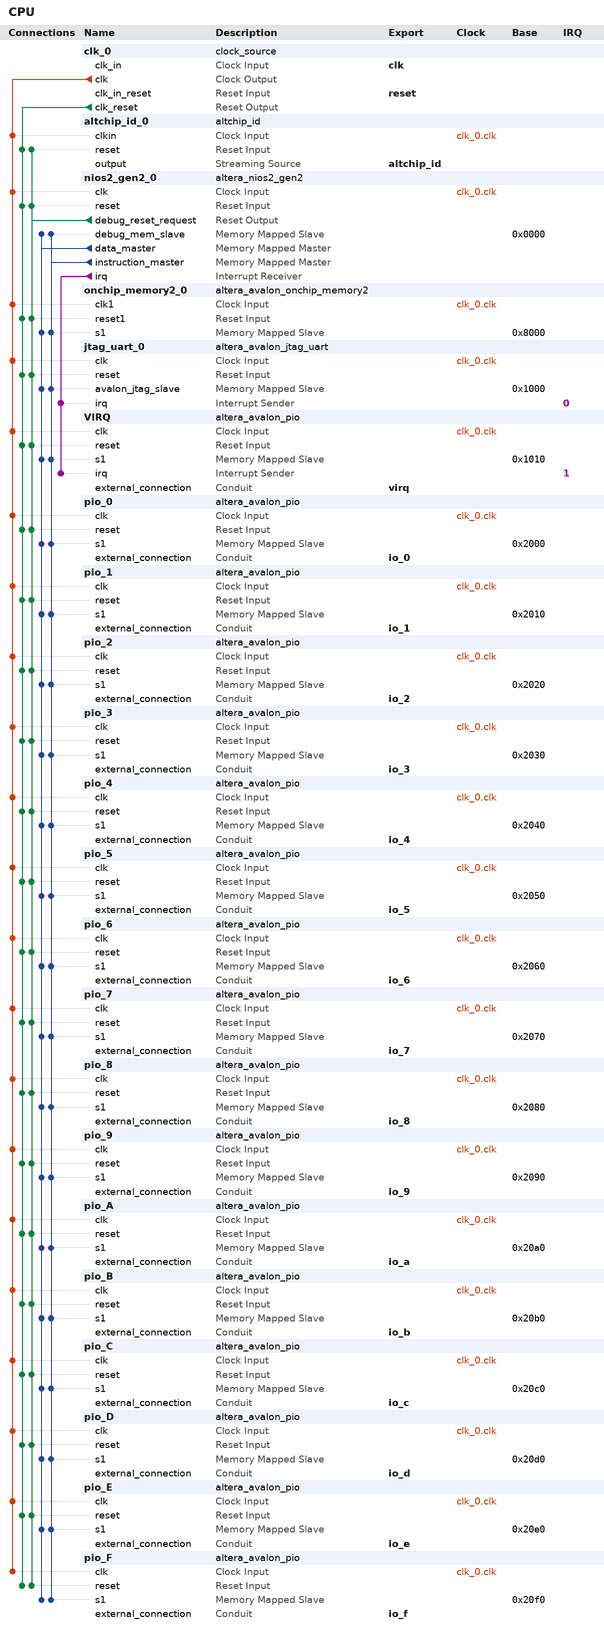
[diagram p0: system contents]
# Platform Designer (Qsys) system CPU, MAX 10 10M08SAE144C8G
# Parameters at their usual value, and those the tool derives, are not listed.
package require -exact qsys 17.1
create_system CPU
set_project_property DEVICE_FAMILY {MAX 10}
set_project_property DEVICE 10M08SAE144C8G

add_instance clk_0 clock_source 17.1
set_instance_parameter_value clk_0 clockFrequency 71590000

add_instance altchip_id_0 altchip_id 17.1
set_instance_parameter_value altchip_id_0 ID_VALUE 18446744073709551615

add_instance nios2_gen2_0 altera_nios2_gen2 17.1
set_instance_parameter_value nios2_gen2_0 dcache_size 2048
set_instance_parameter_value nios2_gen2_0 exceptionSlave onchip_memory2_0.s1
set_instance_parameter_value nios2_gen2_0 icache_size 4096
set_instance_parameter_value nios2_gen2_0 impl Tiny
set_instance_parameter_value nios2_gen2_0 resetSlave onchip_memory2_0.s1

add_instance onchip_memory2_0 altera_avalon_onchip_memory2 17.1
set_instance_parameter_value onchip_memory2_0 dataWidth 32
set_instance_parameter_value onchip_memory2_0 dualPort false
set_instance_parameter_value onchip_memory2_0 initMemContent true
set_instance_parameter_value onchip_memory2_0 initializationFileName onchip_mem.hex
set_instance_parameter_value onchip_memory2_0 memorySize 32768

add_instance jtag_uart_0 altera_avalon_jtag_uart 17.1
set_instance_parameter_value jtag_uart_0 simInteractiveOptions NO_INTERACTIVE_WINDOWS

add_instance VIRQ altera_avalon_pio 17.1
set_instance_parameter_value VIRQ bitClearingEdgeCapReg true
set_instance_parameter_value VIRQ captureEdge true
set_instance_parameter_value VIRQ direction Input
set_instance_parameter_value VIRQ edgeType FALLING
set_instance_parameter_value VIRQ generateIRQ true
set_instance_parameter_value VIRQ irqType EDGE
set_instance_parameter_value VIRQ width 8

add_instance pio_0 altera_avalon_pio 17.1
set_instance_parameter_value pio_0 direction InOut
set_instance_parameter_value pio_0 width 16

add_instance pio_1 altera_avalon_pio 17.1
set_instance_parameter_value pio_1 direction InOut
set_instance_parameter_value pio_1 width 16

add_instance pio_2 altera_avalon_pio 17.1
set_instance_parameter_value pio_2 direction InOut
set_instance_parameter_value pio_2 width 16

add_instance pio_3 altera_avalon_pio 17.1
set_instance_parameter_value pio_3 direction InOut
set_instance_parameter_value pio_3 width 16

add_instance pio_4 altera_avalon_pio 17.1
set_instance_parameter_value pio_4 direction InOut
set_instance_parameter_value pio_4 width 16

add_instance pio_5 altera_avalon_pio 17.1
set_instance_parameter_value pio_5 direction InOut
set_instance_parameter_value pio_5 width 16

add_instance pio_6 altera_avalon_pio 17.1
set_instance_parameter_value pio_6 direction InOut
set_instance_parameter_value pio_6 width 16

add_instance pio_7 altera_avalon_pio 17.1
set_instance_parameter_value pio_7 direction InOut
set_instance_parameter_value pio_7 width 16

add_instance pio_8 altera_avalon_pio 17.1
set_instance_parameter_value pio_8 direction InOut
set_instance_parameter_value pio_8 width 16

add_instance pio_9 altera_avalon_pio 17.1
set_instance_parameter_value pio_9 direction InOut
set_instance_parameter_value pio_9 width 16

add_instance pio_A altera_avalon_pio 17.1
set_instance_parameter_value pio_A direction InOut
set_instance_parameter_value pio_A width 16

add_instance pio_B altera_avalon_pio 17.1
set_instance_parameter_value pio_B direction InOut
set_instance_parameter_value pio_B width 16

add_instance pio_C altera_avalon_pio 17.1
set_instance_parameter_value pio_C direction InOut
set_instance_parameter_value pio_C width 16

add_instance pio_D altera_avalon_pio 17.1
set_instance_parameter_value pio_D direction InOut
set_instance_parameter_value pio_D width 16

add_instance pio_E altera_avalon_pio 17.1
set_instance_parameter_value pio_E direction InOut
set_instance_parameter_value pio_E width 16

add_instance pio_F altera_avalon_pio 17.1
set_instance_parameter_value pio_F direction InOut
set_instance_parameter_value pio_F width 16

# connections
add_connection clk_0.clk altchip_id_0.clkin clock
add_connection clk_0.clk jtag_uart_0.clk clock
add_connection clk_0.clk nios2_gen2_0.clk clock
add_connection clk_0.clk onchip_memory2_0.clk1 clock
add_connection clk_0.clk pio_0.clk clock
add_connection clk_0.clk pio_1.clk clock
add_connection clk_0.clk pio_2.clk clock
add_connection clk_0.clk pio_3.clk clock
add_connection clk_0.clk pio_4.clk clock
add_connection clk_0.clk pio_5.clk clock
add_connection clk_0.clk pio_6.clk clock
add_connection clk_0.clk pio_7.clk clock
add_connection clk_0.clk pio_8.clk clock
add_connection clk_0.clk pio_9.clk clock
add_connection clk_0.clk pio_A.clk clock
add_connection clk_0.clk pio_B.clk clock
add_connection clk_0.clk pio_C.clk clock
add_connection clk_0.clk pio_D.clk clock
add_connection clk_0.clk pio_E.clk clock
add_connection clk_0.clk pio_F.clk clock
add_connection clk_0.clk VIRQ.clk clock
add_connection clk_0.clk_reset altchip_id_0.reset reset
add_connection clk_0.clk_reset jtag_uart_0.reset reset
add_connection clk_0.clk_reset nios2_gen2_0.reset reset
add_connection clk_0.clk_reset onchip_memory2_0.reset1 reset
add_connection clk_0.clk_reset pio_0.reset reset
add_connection clk_0.clk_reset pio_1.reset reset
add_connection clk_0.clk_reset pio_2.reset reset
add_connection clk_0.clk_reset pio_3.reset reset
add_connection clk_0.clk_reset pio_4.reset reset
add_connection clk_0.clk_reset pio_5.reset reset
add_connection clk_0.clk_reset pio_6.reset reset
add_connection clk_0.clk_reset pio_7.reset reset
add_connection clk_0.clk_reset pio_8.reset reset
add_connection clk_0.clk_reset pio_9.reset reset
add_connection clk_0.clk_reset pio_A.reset reset
add_connection clk_0.clk_reset pio_B.reset reset
add_connection clk_0.clk_reset pio_C.reset reset
add_connection clk_0.clk_reset pio_D.reset reset
add_connection clk_0.clk_reset pio_E.reset reset
add_connection clk_0.clk_reset pio_F.reset reset
add_connection clk_0.clk_reset VIRQ.reset reset
add_connection nios2_gen2_0.debug_reset_request altchip_id_0.reset reset
add_connection nios2_gen2_0.debug_reset_request jtag_uart_0.reset reset
add_connection nios2_gen2_0.debug_reset_request nios2_gen2_0.reset reset
add_connection nios2_gen2_0.debug_reset_request onchip_memory2_0.reset1 reset
add_connection nios2_gen2_0.debug_reset_request pio_0.reset reset
add_connection nios2_gen2_0.debug_reset_request pio_1.reset reset
add_connection nios2_gen2_0.debug_reset_request pio_2.reset reset
add_connection nios2_gen2_0.debug_reset_request pio_3.reset reset
add_connection nios2_gen2_0.debug_reset_request pio_4.reset reset
add_connection nios2_gen2_0.debug_reset_request pio_5.reset reset
add_connection nios2_gen2_0.debug_reset_request pio_6.reset reset
add_connection nios2_gen2_0.debug_reset_request pio_7.reset reset
add_connection nios2_gen2_0.debug_reset_request pio_8.reset reset
add_connection nios2_gen2_0.debug_reset_request pio_9.reset reset
add_connection nios2_gen2_0.debug_reset_request pio_A.reset reset
add_connection nios2_gen2_0.debug_reset_request pio_B.reset reset
add_connection nios2_gen2_0.debug_reset_request pio_C.reset reset
add_connection nios2_gen2_0.debug_reset_request pio_D.reset reset
add_connection nios2_gen2_0.debug_reset_request pio_E.reset reset
add_connection nios2_gen2_0.debug_reset_request pio_F.reset reset
add_connection nios2_gen2_0.debug_reset_request VIRQ.reset reset
add_connection nios2_gen2_0.data_master jtag_uart_0.avalon_jtag_slave avalon
set_connection_parameter_value nios2_gen2_0.data_master/jtag_uart_0.avalon_jtag_slave baseAddress 0x1000
add_connection nios2_gen2_0.data_master nios2_gen2_0.debug_mem_slave avalon
set_connection_parameter_value nios2_gen2_0.data_master/nios2_gen2_0.debug_mem_slave baseAddress 0x0000
add_connection nios2_gen2_0.data_master onchip_memory2_0.s1 avalon
set_connection_parameter_value nios2_gen2_0.data_master/onchip_memory2_0.s1 baseAddress 0x8000
add_connection nios2_gen2_0.data_master pio_0.s1 avalon
set_connection_parameter_value nios2_gen2_0.data_master/pio_0.s1 baseAddress 0x2000
add_connection nios2_gen2_0.data_master pio_1.s1 avalon
set_connection_parameter_value nios2_gen2_0.data_master/pio_1.s1 baseAddress 0x2010
add_connection nios2_gen2_0.data_master pio_2.s1 avalon
set_connection_parameter_value nios2_gen2_0.data_master/pio_2.s1 baseAddress 0x2020
add_connection nios2_gen2_0.data_master pio_3.s1 avalon
set_connection_parameter_value nios2_gen2_0.data_master/pio_3.s1 baseAddress 0x2030
add_connection nios2_gen2_0.data_master pio_4.s1 avalon
set_connection_parameter_value nios2_gen2_0.data_master/pio_4.s1 baseAddress 0x2040
add_connection nios2_gen2_0.data_master pio_5.s1 avalon
set_connection_parameter_value nios2_gen2_0.data_master/pio_5.s1 baseAddress 0x2050
add_connection nios2_gen2_0.data_master pio_6.s1 avalon
set_connection_parameter_value nios2_gen2_0.data_master/pio_6.s1 baseAddress 0x2060
add_connection nios2_gen2_0.data_master pio_7.s1 avalon
set_connection_parameter_value nios2_gen2_0.data_master/pio_7.s1 baseAddress 0x2070
add_connection nios2_gen2_0.data_master pio_8.s1 avalon
set_connection_parameter_value nios2_gen2_0.data_master/pio_8.s1 baseAddress 0x2080
add_connection nios2_gen2_0.data_master pio_9.s1 avalon
set_connection_parameter_value nios2_gen2_0.data_master/pio_9.s1 baseAddress 0x2090
add_connection nios2_gen2_0.data_master pio_A.s1 avalon
set_connection_parameter_value nios2_gen2_0.data_master/pio_A.s1 baseAddress 0x20a0
add_connection nios2_gen2_0.data_master pio_B.s1 avalon
set_connection_parameter_value nios2_gen2_0.data_master/pio_B.s1 baseAddress 0x20b0
add_connection nios2_gen2_0.data_master pio_C.s1 avalon
set_connection_parameter_value nios2_gen2_0.data_master/pio_C.s1 baseAddress 0x20c0
add_connection nios2_gen2_0.data_master pio_D.s1 avalon
set_connection_parameter_value nios2_gen2_0.data_master/pio_D.s1 baseAddress 0x20d0
add_connection nios2_gen2_0.data_master pio_E.s1 avalon
set_connection_parameter_value nios2_gen2_0.data_master/pio_E.s1 baseAddress 0x20e0
add_connection nios2_gen2_0.data_master pio_F.s1 avalon
set_connection_parameter_value nios2_gen2_0.data_master/pio_F.s1 baseAddress 0x20f0
add_connection nios2_gen2_0.data_master VIRQ.s1 avalon
set_connection_parameter_value nios2_gen2_0.data_master/VIRQ.s1 baseAddress 0x1010
add_connection nios2_gen2_0.instruction_master jtag_uart_0.avalon_jtag_slave avalon
set_connection_parameter_value nios2_gen2_0.instruction_master/jtag_uart_0.avalon_jtag_slave baseAddress 0x1000
add_connection nios2_gen2_0.instruction_master nios2_gen2_0.debug_mem_slave avalon
set_connection_parameter_value nios2_gen2_0.instruction_master/nios2_gen2_0.debug_mem_slave baseAddress 0x0000
add_connection nios2_gen2_0.instruction_master onchip_memory2_0.s1 avalon
set_connection_parameter_value nios2_gen2_0.instruction_master/onchip_memory2_0.s1 baseAddress 0x8000
add_connection nios2_gen2_0.instruction_master pio_0.s1 avalon
set_connection_parameter_value nios2_gen2_0.instruction_master/pio_0.s1 baseAddress 0x2000
add_connection nios2_gen2_0.instruction_master pio_1.s1 avalon
set_connection_parameter_value nios2_gen2_0.instruction_master/pio_1.s1 baseAddress 0x2010
add_connection nios2_gen2_0.instruction_master pio_2.s1 avalon
set_connection_parameter_value nios2_gen2_0.instruction_master/pio_2.s1 baseAddress 0x2020
add_connection nios2_gen2_0.instruction_master pio_3.s1 avalon
set_connection_parameter_value nios2_gen2_0.instruction_master/pio_3.s1 baseAddress 0x2030
add_connection nios2_gen2_0.instruction_master pio_4.s1 avalon
set_connection_parameter_value nios2_gen2_0.instruction_master/pio_4.s1 baseAddress 0x2040
add_connection nios2_gen2_0.instruction_master pio_5.s1 avalon
set_connection_parameter_value nios2_gen2_0.instruction_master/pio_5.s1 baseAddress 0x2050
add_connection nios2_gen2_0.instruction_master pio_6.s1 avalon
set_connection_parameter_value nios2_gen2_0.instruction_master/pio_6.s1 baseAddress 0x2060
add_connection nios2_gen2_0.instruction_master pio_7.s1 avalon
set_connection_parameter_value nios2_gen2_0.instruction_master/pio_7.s1 baseAddress 0x2070
add_connection nios2_gen2_0.instruction_master pio_8.s1 avalon
set_connection_parameter_value nios2_gen2_0.instruction_master/pio_8.s1 baseAddress 0x2080
add_connection nios2_gen2_0.instruction_master pio_9.s1 avalon
set_connection_parameter_value nios2_gen2_0.instruction_master/pio_9.s1 baseAddress 0x2090
add_connection nios2_gen2_0.instruction_master pio_A.s1 avalon
set_connection_parameter_value nios2_gen2_0.instruction_master/pio_A.s1 baseAddress 0x20a0
add_connection nios2_gen2_0.instruction_master pio_B.s1 avalon
set_connection_parameter_value nios2_gen2_0.instruction_master/pio_B.s1 baseAddress 0x20b0
add_connection nios2_gen2_0.instruction_master pio_C.s1 avalon
set_connection_parameter_value nios2_gen2_0.instruction_master/pio_C.s1 baseAddress 0x20c0
add_connection nios2_gen2_0.instruction_master pio_D.s1 avalon
set_connection_parameter_value nios2_gen2_0.instruction_master/pio_D.s1 baseAddress 0x20d0
add_connection nios2_gen2_0.instruction_master pio_E.s1 avalon
set_connection_parameter_value nios2_gen2_0.instruction_master/pio_E.s1 baseAddress 0x20e0
add_connection nios2_gen2_0.instruction_master pio_F.s1 avalon
set_connection_parameter_value nios2_gen2_0.instruction_master/pio_F.s1 baseAddress 0x20f0
add_connection nios2_gen2_0.instruction_master VIRQ.s1 avalon
set_connection_parameter_value nios2_gen2_0.instruction_master/VIRQ.s1 baseAddress 0x1010
add_connection nios2_gen2_0.irq jtag_uart_0.irq interrupt
set_connection_parameter_value nios2_gen2_0.irq/jtag_uart_0.irq irqNumber 0
add_connection nios2_gen2_0.irq VIRQ.irq interrupt
set_connection_parameter_value nios2_gen2_0.irq/VIRQ.irq irqNumber 1

# exported interfaces
add_interface altchip_id avalon_streaming source
set_interface_property altchip_id EXPORT_OF altchip_id_0.output
add_interface clk clock sink
set_interface_property clk EXPORT_OF clk_0.clk_in
add_interface io_0 conduit end
set_interface_property io_0 EXPORT_OF pio_0.external_connection
add_interface io_1 conduit end
set_interface_property io_1 EXPORT_OF pio_1.external_connection
add_interface io_2 conduit end
set_interface_property io_2 EXPORT_OF pio_2.external_connection
add_interface io_3 conduit end
set_interface_property io_3 EXPORT_OF pio_3.external_connection
add_interface io_4 conduit end
set_interface_property io_4 EXPORT_OF pio_4.external_connection
add_interface io_5 conduit end
set_interface_property io_5 EXPORT_OF pio_5.external_connection
add_interface io_6 conduit end
set_interface_property io_6 EXPORT_OF pio_6.external_connection
add_interface io_7 conduit end
set_interface_property io_7 EXPORT_OF pio_7.external_connection
add_interface io_8 conduit end
set_interface_property io_8 EXPORT_OF pio_8.external_connection
add_interface io_9 conduit end
set_interface_property io_9 EXPORT_OF pio_9.external_connection
add_interface io_a conduit end
set_interface_property io_a EXPORT_OF pio_A.external_connection
add_interface io_b conduit end
set_interface_property io_b EXPORT_OF pio_B.external_connection
add_interface io_c conduit end
set_interface_property io_c EXPORT_OF pio_C.external_connection
add_interface io_d conduit end
set_interface_property io_d EXPORT_OF pio_D.external_connection
add_interface io_e conduit end
set_interface_property io_e EXPORT_OF pio_E.external_connection
add_interface io_f conduit end
set_interface_property io_f EXPORT_OF pio_F.external_connection
add_interface reset reset sink
set_interface_property reset EXPORT_OF clk_0.clk_in_reset
add_interface virq conduit end
set_interface_property virq EXPORT_OF VIRQ.external_connection

set_interconnect_requirement {$system} qsys_mm.clockCrossingAdapter HANDSHAKE
set_interconnect_requirement {$system} qsys_mm.enableEccProtection FALSE
set_interconnect_requirement {$system} qsys_mm.insertDefaultSlave FALSE
set_interconnect_requirement {$system} qsys_mm.maxAdditionalLatency 1

save_system CPU.qsys
